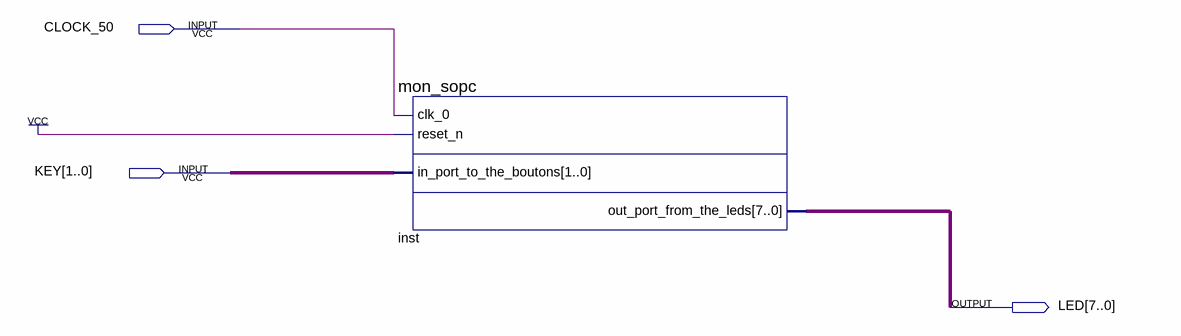
[diagram p0: schematic sheet]
// Quartus schematic sopc_compteur.bdf as structural Verilog: 1 symbols, 3 pins
module sopc_compteur (
  input  CLOCK_50,
  input  [1:0] KEY,
  output [7:0] LED
);

  mon_sopc inst (.clk_0(CLOCK_50), .reset_n(1'b1), .in_port_to_the_boutons(KEY), .out_port_from_the_leds(LED));
endmodule
